# Altium schematic sheet COVER_PAGE.SchDoc
size A4; SheetNumber: 2; SheetTotal: 2
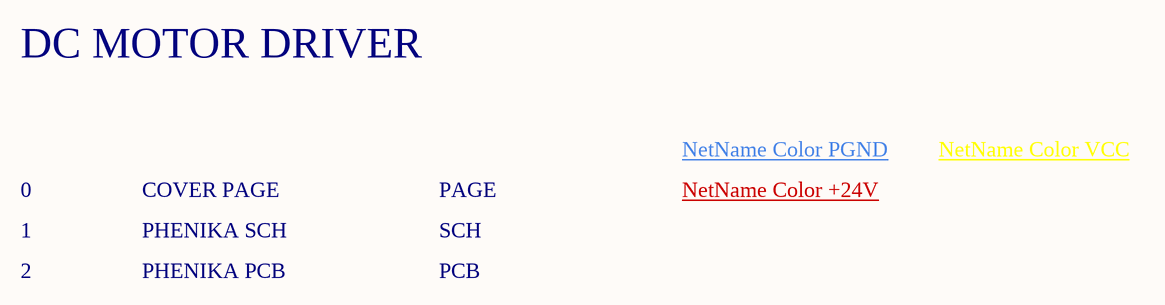
[diagram p0: COVER_PAGE.SchDoc]

## Notes on the sheet
- DC MOTOR DRIVER
- 0
- COVER PAGE
- PAGE
- NetName Color PGND
- NetName Color +24V
- NetName Color VCC
- 1
- PHENIKA SCH
- SCH
- 2
- PHENIKA PCB
- PCB
- DESCRIPTION
- TYPE
- DESIGN CONSIDERATIONS
- HISTORY DESIGN VERSION
- REVISIONS
- DATE
- DESIGN NOTE
- DESGIN INFORMATION
- Note for Desgin and Layout
- Explain function or information about that area
- Lần
- Nội dung thay đổi
- Ngày
- Khối lượng:
- Sheet:
- Tên bản vẽ:
- Vật liệu:
- Thiết kế
- Kiểm tra
- Số lượng:
- Phê duyệt
- Mã LK bản vẽ:
- Tên sản phẩm:
- Đơn vị
- Mã sản phẩm:
- Phiên bản
- Tỷ lệ
- Trang
- TEAM R&D by Mr SAO